# Altium project OptocouplerV2.PrjPcb
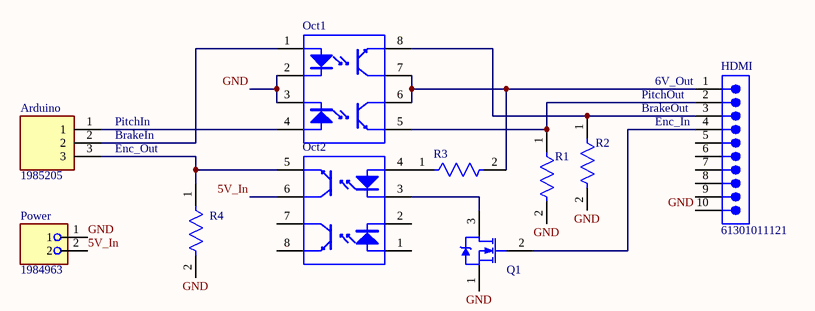
[diagram p0: OptocouplerV2.SchDoc]
1 sheet, 10 parts. Net scope: global (net labels, ports and power ports of the same name join across sheets).
Board files: OptocouplerV2.PcbDoc, OptocouplerV2shop.PcbDoc

## Sheet OptocouplerV2.SchDoc
size A; SheetNumber: 1; SheetTotal: 1

### Parts
Arduino  1985205  [TE_1985205]
HDMI  61301011121  [61301011121]
Oct1  (no value)  [VISH-DIP8]
Oct2  (no value)  [VISH-DIP8]
Power  1984963  [PHOENIX_1984963]
Q1  (no value)  [ONSC-TO-92-3-29-11_AM_BL]
R1  (no value)  [FP-MRS25-MFG]
R2  (no value)  [FP-MRS25-MFG]
R3  (no value)  [FP-MRS25-MFG]
R4  (no value)  [FP-MRS25-MFG]

### Nets
5V_In: Oct2.6(C) Power.2
GND: HDMI.10 Oct1.2(C) Oct1.3(C) Power.1 Q1.1(S) R1.2 R2.2 R4.2
NetArduino_1: Arduino.1 Oct1.4(A)
NetArduino_2: Arduino.2 Oct1.1(A)
NetArduino_3: Arduino.3 Oct2.5(E) R4.1
NetHDMI_1: HDMI.1 Oct1.6(C) Oct1.7(C) R3.2
NetHDMI_2: HDMI.2 Oct1.5(E) R1.1
NetHDMI_3: HDMI.3 Oct1.8(E) R2.1
NetHDMI_4: HDMI.4 Q1.2(G)
NetOct2_3: Oct2.3(C) Q1.3(D)
NetOct2_4: Oct2.4(A) R3.1

Not connected (* = marked no-connect by the designer): HDMI 5 6 7 8 9; Oct2 1(A) 2(C) 7(C) 8(E)

### Notes on the sheet
- (near HDMI) 6V_Out
- (near Arduino) PitchIn
- (near Arduino) BrakeIn
- (near Arduino) Enc_Out
- (near HDMI) PitchOut
- (near HDMI) BrakeOut
- (near HDMI) Enc_In

### Library data of the parts
Arduino = CMP-003-000000-1: PCB Terminal Push-In 3.5mm 16AWG 400V 8A 3 Position COMBICON PTSA Series; MF: Phoenix Contact; Check_prices: https://www.snapeda.com/parts/1985205/Phoenix+Contact/view-part/?ref=eda; SnapEDA_Link: https://www.snapeda.com/parts/1985205/Phoenix+Contact/view-part/?ref=snap; Value: *; Source: 1985205.SchLib; Package: None; Design Item ID: 1985205; Component Type: Standard; Pin Count: 3; MP: 1985205
HDMI = CMP-1502-01082-5: NexarPartId: 18818159; Gender: Male; Number of Positions: 10; Operating Supply Voltage: 250V; Current Rating: 3A; Contact Resistance: 20mΩ; Connector Type: Male Pin; Insulation Resistance: 1GΩ; Pitch: 2.54mm; Color: Black; Contact Gender: Male; Height: 8.74mm; Orientation: Vertical; RoHS: Compliant; Packaging: Bulk; Min Operating Temperature: -40°C; Number of Pins: 10; Max Operating Temperature: 105°C; REACH SVHC: Unknown; Voltage Rating: 250V; Number of Rows: 1; Housing Material: PBT; Number of Contacts: 10; Mount: Through Hole; Contact Mating Length: 5.9944mm; Length: 2.54mm; Lead Pitch: 2.54mm; Flammability Rating: UL94 V-0; Termination: Solder; Contact Material: Copper; Width: 25.4mm; Contact Plating: Gold
Oct1 Oct2 = CMP-1666-00026-1: Optocoupler, Phototransistor Output, Dual Channel, 1.3 V, -55 to 100 degC, 8-Pin DIP, RoHS, Tube; Case\Package: Axial; Power Rating: 250 mW; Voltage Rating: 250 V; Tolerance: 1%; Resistance: 22.1 Ohm; ComponentLink3Description: Package Specification; ComponentLink3URL: http://www.vishay.com/docs/83241/83241.pdf; Mount: Through Hole; DatasheetVersion: Rev. 1.7, 05/2011; PackageVersion: Rev. 1.1, 12/2003; Package Quantity: 200; PackageReference: DIP8; Min Operating Temperature: -55 degC; Length: 0.248 inch; ComponentLink2URL: http://www.vishay.com/docs/83640/ild74.pdf; Packaging: Bulk; RoHSCompliant: true; ComponentLink1URL: http://www.vishay.com/; PackageDescription: 8-Pin Double In-line Package, Body 9.77 x 6.645 mm, Pitch 2.54 mm; ComponentLink1Description: Manufacturer URL; Max Operating Temperature: 155 degC; ComponentLink2Description: Datasheet
Power = CMP-005-000000-1: Value: *; MP: 1984963; Design Item ID: 1984963; Pin Count: 2; Price: None; Component Type: Standard; Source: 1984963.SchLib; Availability: Unavailable; Package: None
Q1 = CMP-1058-00942-1: Small Signal MOSFET, 200 mA, 60 V, N-Channel, 3-Pin TO-92, Pb-Free, Tape and Reel; Manufacturer: On Semiconductor; PartNumber: 2N7000RLRAG; Crss Typ (pF): 5; Ciss Typ (pF): 60; Channel Polarity: N Channel; Coss Typ (pF): 25; VGS(th) Max (V): 3; ID Max (A): 0.2; VGS Max (V): 20; Configuration: Single; PD Max (W): 0.35; ComponentLink3Description: Package Specification; Package Type: TO-92; Mounting Technology: Through Hole; ComponentLink2Description: Datasheet; ComponentLink1Description: Manufacturer URL; ComponentLink1URL: http://www.onsemi.com/; DatasheetVersion: Rev. 8; RoHS: Pb-Free; Packing: Tape and Reel; PackageReference: TO-92-3-29-11_AM_BL; ComponentLink3URL: http://www.onsemi.com/pub_link/Collateral/MAC97-D.PDF; PackageDescription: 3-Pin Transistor Outline, Body 4.825 x 3.685 mm, Pitch 1.27 mm; PackageVersion: Rev. AM; ComponentLink2URL: http://www.onsemi.com/pub_link/Collateral/2N7000-D.PDF; V(BR)DSS Min (V): 60
R1-R4 = CMP-00030-42757237-1: MRS25000C1000FRP00 Resistor, 100 Ohm, ± 1%, 600 mW, Axial Leaded, Metal Film (Thin Film), Professional; Max Power Dissipation: 600mW; Resistance: 100Ω; Voltage Rating: 350V; Temperature Coefficient: 50ppm/°C; Lead Diameter: 600µm; RoHS: Compliant; Radiation Hardening: No; Schedule B: 8533210090, 8533210090; Length: 6.5mm; Packaging: Tape & Reel (TR); Number of Terminations: 2; Mount: Through Hole; Width: 2.5mm; Tolerance: 1%; Military Standard: Not; Voltage Rating (DC): 350V; Contact Plating: Tin; Number of Pins: 2; Max Operating Temperature: 155°C; NexarPartId: 42757237; Diameter: 2.5mm; Composition: Metal Film, Thin Film; REACH SVHC: Unknown; Power Rating: 600mW; Lead Free: Lead Free; Termination: Axial; Case/Package: Axial; Min Operating Temperature: -55°C